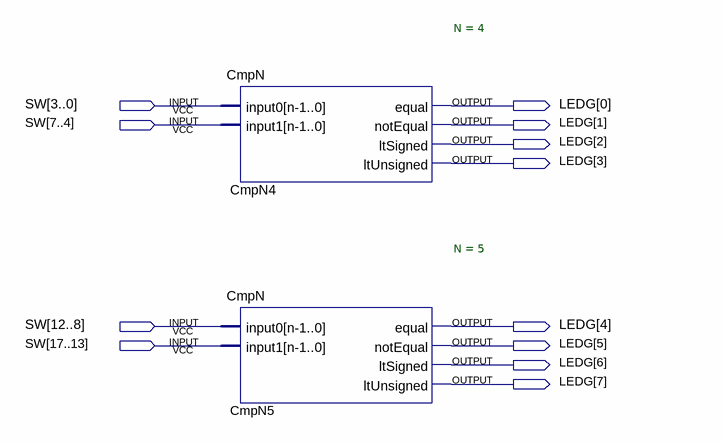
[diagram p0: schematic sheet]
// Quartus schematic CmpN_Demo.bdf as structural Verilog: 2 symbols, 12 pins
module CmpN_Demo (
  input  [17:0] SW,
  output [7:0] LEDG
);

  CmpN #(.N(4)) CmpN4 (
    .input0(SW[3:0]), .input1(SW[7:4]), .equal(LEDG[0]), .notEqual(LEDG[1]), .ltSigned(LEDG[2]),
    .ltUnsigned(LEDG[3]));
  CmpN #(.N(5)) CmpN5 (
    .input0(SW[12:8]), .input1(SW[17:13]), .equal(LEDG[4]), .notEqual(LEDG[5]), .ltSigned(LEDG[6]),
    .ltUnsigned(LEDG[7]));
endmodule
